# EasyEDA Pro project ProPrj_Microros_esp32_2025-06-17.epro, board PCB_POWER
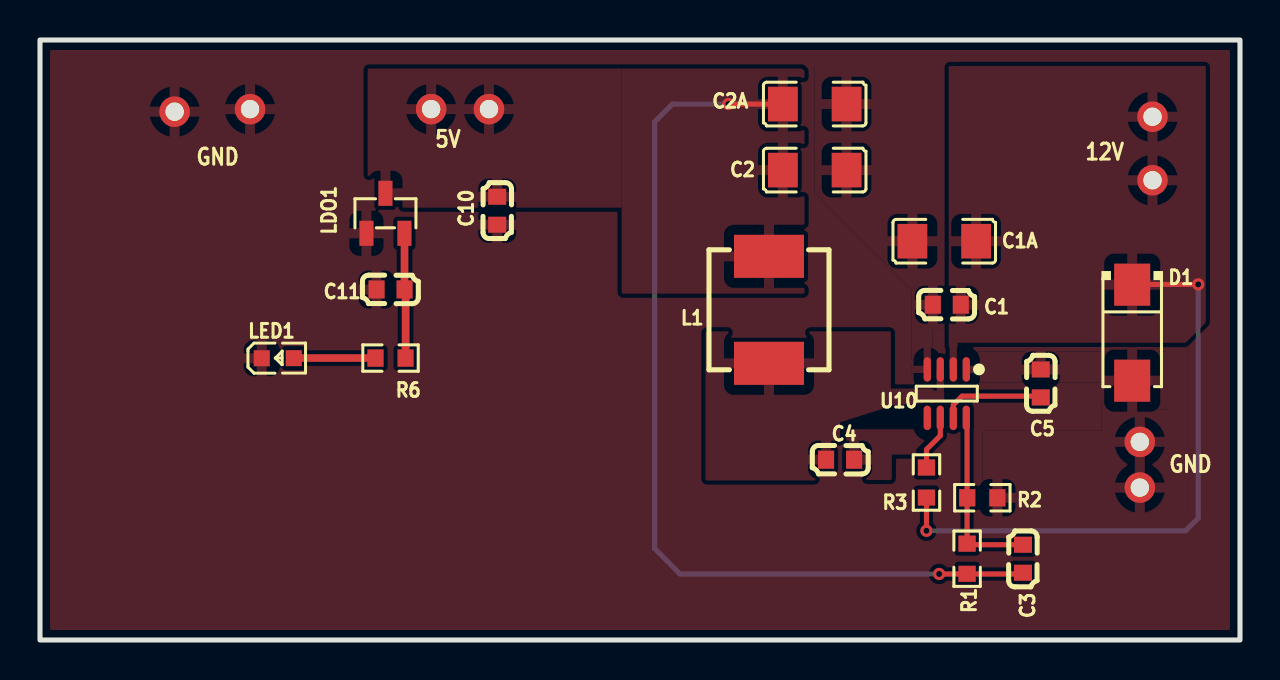
[diagram p6: board, top side]
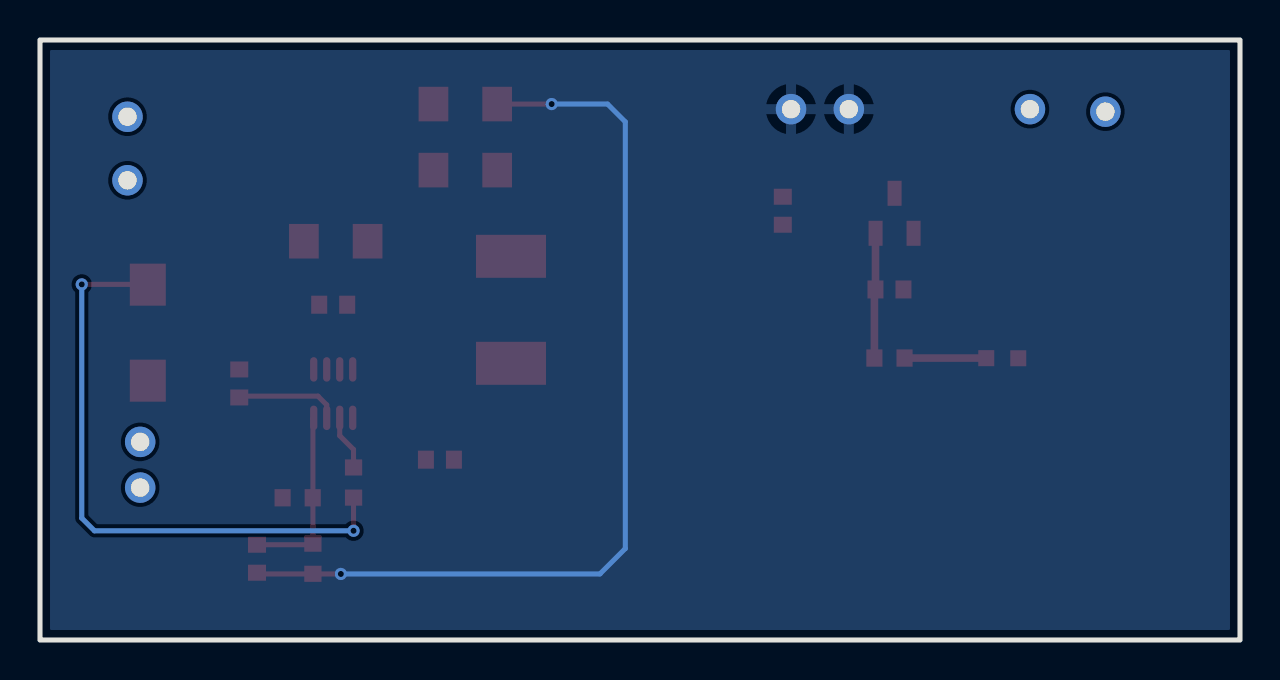
[diagram p7: board, bottom side, seen from below]

Outline 60 x 30 mm; copper layers: Top Layer, Bottom Layer. Coordinates in mm from the lower left corner of the outline.
Outline path: rectangle 0,30 60,0
Stack: Top Layer 0.035mm / Dielectric1 1.51mm FR4 er 4.5 / Bottom Layer 0.035mm

## Design rules (mm)
template: 自定义配置
spacing copperThickness1oz (default): track to track 0.102, other pairs 0.152 to 0.3
spacing copperThickness2oz: track to track 0.203, other pairs 0.152 to 0.3
track width copperThickness1oz (default): min 0.127, default 0.254, max 2.54
track width copperThickness2oz: min 0.203, default 0.254, max 2.54
differential pair differentialPair (default): width min 0.127, default 0.254, max 2.54; gap min 0.152, default 0.152
via viaSize (default): diameter min 0.5, default 0.61, max 10; hole min 0.3, default 0.305, max 6.3

## Placement (name value [footprint] x y rotation side)
C1  0.1uf  [C0603]  45.34 16.76 0 top
C1A  22uf  [C1206]  45.21 19.94 0 top
C2  22uf  [C1206]  38.74 23.5 180 top
C2A  22uf  [C1206]  38.74 26.8 0 top
C3  33PF  [C0603]  49.15 4.06 90 top
C4  0.1uf  [C0603]  40 9.02 180 top
C5  0.1uf  [C0603]  50.04 12.83 270 top
C10  1uf  [C0603]  22.86 21.46 270 top
C11  1uf  [C0603]  17.53 17.53 0 top
D1  SMAJ12A  [SMA_L4.3-W2.8-LS5.1-RD]  54.61 15.37 270 top
L1  4.7uH  [IND-SMD_L6.5-W6.0_GPSR0630]  36.45 16.51 90 top
LDO1  SC662K-3.3V  [SOT-23-3_L2.9-W1.3-P1.90-LS2.4-BR]  17.27 21.34 270 top
LED1  -  [LED_0603]  11.94 14.1 0 top
NOREF  -  [Pad_e155]  10.5 26.54 0 top
NOREF#2  -  [Pad_e151]  54.99 9.91 0 top
NOREF#3  -  [Pad_e150]  55.63 22.99 0 top
NOREF#4  -  [Pad_e156]  6.73 26.42 0 top
NOREF#5  -  [Pad_e152]  54.99 7.62 0 top
NOREF#6  -  [Pad_e154]  22.45 26.54 0 top
NOREF#7  -  [Pad_e149]  55.63 26.16 0 top
NOREF#8  -  [Pad_e153]  19.56 26.54 0 top
R1  -  [R0603]  46.35 4.06 90 top
R2  -  [R0603]  47.12 7.11 0 top
R3  -  [R0603]  44.32 7.87 90 top
R6  -  [R0603]  17.53 14.1 180 top
U10  MP2225GJ-Z  [TSOT-23-8_L2.9-W1.6-P0.65-LS2.8-BR]  45.34 12.32 90 top

## Footprints (pads in the part's own frame, mm; a bottom-side part is the same pattern mirrored in y, then rotated)
C0603
  rect 0.8x0.9 smd: 1(-0.7,0) 2(0.7,0)
C1206
  rect 1.485x1.728 smd: 1(-1.593,0) 2(1.593,0)
IND-SMD_L6.5-W6.0_GPSR0630
  rect 2.15x3.5 smd: 1(-2.675,0) 2(2.675,0)
LED_0603
  rect 0.8x0.8 smd: 1(-0.851,-0.01) 2(0.75,-0.005)
Pad_e149
  round 1.524 hole 0.914: 9(0,0)
Pad_e150
  round 1.524 hole 0.914: 10(0,0)
Pad_e151
  round 1.524 hole 0.914: 11(0,0)
Pad_e152
  round 1.524 hole 0.914: 12(0,0)
Pad_e153
  round 1.524 hole 0.914: 13(0,0)
Pad_e154
  round 1.524 hole 0.914: 14(0,0)
Pad_e155
  round 1.524 hole 0.914: 15(0,0)
Pad_e156
  round 1.524 hole 0.914: 16(0,0)
R0603
  rect 0.806x0.864 smd: 1(-0.753,0) 2(0.753,0)
SMA_L4.3-W2.8-LS5.1-RD
  rect 2.1x1.8 smd: 1(-2.4,0) 2(2.4,0)
SOT-23-3_L2.9-W1.3-P1.90-LS2.4-BR
  rect 1.25x0.7 smd: 1(1,-0.95) 2(1,0.95) 3(-1,0)
TSOT-23-8_L2.9-W1.6-P0.65-LS2.8-BR
  oval 1.222x0.364 smd: 1(1.211,-0.975) 2(1.211,-0.325) 3(1.211,0.325) 4(1.211,0.975) 5(-1.211,0.975) 6(-1.211,0.325) 7(-1.211,-0.325) 8(-1.211,-0.975)

## Nets
+5V: C2.2 C2A.1 C3.1 C10.1 L1.2 LDO1.3 NOREF#6.14 NOREF#8.13 R1.1
+12V: C1.2 C1A.2 D1.1 NOREF#3.10 NOREF#7.9 R3.1 U10.2
GND: C1.1 C1A.1 C2.1 C2A.2 C5.1 C10.2 C11.1 D1.2 LDO1.1 LED1.1 NOREF.15 NOREF#2.11 NOREF#4.16 NOREF#5.12 R2.2 U10.1 U10.4
VCC_3V3: C11.2 LDO1.2 R6.1
$1N931: C5.2 U10.7
$1N1050: R3.2 U10.6
$1N1174: C4.2 L1.1 U10.3
$1N1183: C4.1 U10.5
$1N1509: C3.2 R1.2 R2.1 U10.8
$1N1839: LED1.2 R6.2

## Via types
v1: diameter 0.61, hole 0.305, Top Layer to Bottom Layer, 4 vias

## Routing (per net, layer and track width the routed paths; a pad name or vN(x,y) marks a point on that pad's centre or on a via; arc(x,y) is an arc through that point)
+5V: length 47.1
  Top Layer w0.254: C2A.1 v1(34.42,26.8) ; C3.1 49.09,3.3 46.35,3.3 ; 46.35,3.3 R1.1 ; 46.35,3.3 v1(44.96,3.3)
  Bottom Layer w0.254: v1(44.96,3.3) 32,3.3 30.73,4.57 30.73,25.91 31.62,26.8 v1(34.42,26.8)
+12V: length 30.5
  Top Layer w0.254: R3.1 v1(44.32,5.46) ; v1(57.91,17.78) 54.62,17.78 D1.1
  Bottom Layer w0.254: v1(57.91,17.78) 57.91,6.1 57.28,5.46 v1(44.32,5.46)
VCC_3V3: length 6.3
  Top Layer w0.381: R6.1 18.28,17.47 C11.2 18.23,20.33 LDO1.2
$1N931: length 5.2
  Top Layer w0.254: U10.7 45.66,11.75 46.1,12.19 49.97,12.19 C5.2
$1N1050: length 2.8
  Top Layer w0.254: U10.6 45.01,10.22 44.32,9.53 R3.2
$1N1509: length 9.1
  Top Layer w0.254: 46.35,7.1 46.35,11.07 U10.8 ; 46.35,7.1 R1.2 46.41,4.76 C3.2 ; 46.35,7.1 R2.1
$1N1839: length 4.1
  Top Layer w0.381: LED1.2 12.69,14.1 R6.2

## Copper pours and planes (outline as drawn; the poured copper is in the pictures)
+5V on Top Layer: 38.23,17.27 38.23,28.45 38.1,28.58 29.08,28.58 29.08,17.32 38.18,17.32
+5V on Top Layer: 16.38,21.62 31.01,21.62 31.01,28.58 16.38,28.58
+5V on Bottom Layer: -4.57,35.56 62.97,35.56 62.97,-6.86 -4.57,-6.86
+12V on Top Layer: 45.98,28.7 58.29,28.7 58.29,15.88 57.28,14.86 45.89,14.86 45.89,12.95 45.44,12.95 45.44,28.7 45.97,28.7
GND on Top Layer: 46.09,12.87 53.15,12.87 53.15,11.52 56.35,11.52 56.35,14.42 46.09,14.42
GND on Top Layer: -4.57,35.05 63.37,35.05 63.37,-6.86 -4.57,-6.86
GND on Top Layer: 47.12,10.46 47.12,6.35 57.28,6.35 57.4,6.35 57.4,14.61 53.09,14.61 53.09,10.46
GND on Top Layer: 38.74,28.7 38.74,22.35 43.56,17.53 43.56,12.95 44.62,12.95 44.62,15.55 45.26,15.55 45.26,28.7
$1N1174 on Top Layer: 40,7.97 33.27,7.97 33.27,15.44 42.54,15.44 42.54,12.57 44.79,12.57 44.79,14.1 45.25,14.1 45.25,12.61 45.21,12.57 45.21,11.93 42.65,11.73 40,10.88
$1N1183 on Top Layer: 40.3,10.53 40.34,10.54 43.96,10.54 44.18,11.68 44.54,11.68 44.54,10.26 43.81,9.53 43.81,9.27 42.59,9.27 42.59,8.05 42.54,8 40.3,8

## Text on the board
Top Silkscreen Layer: GND | 5V | 12V
